# EAGLE design kooz_v0.1 (EAGLE 7.2.0)
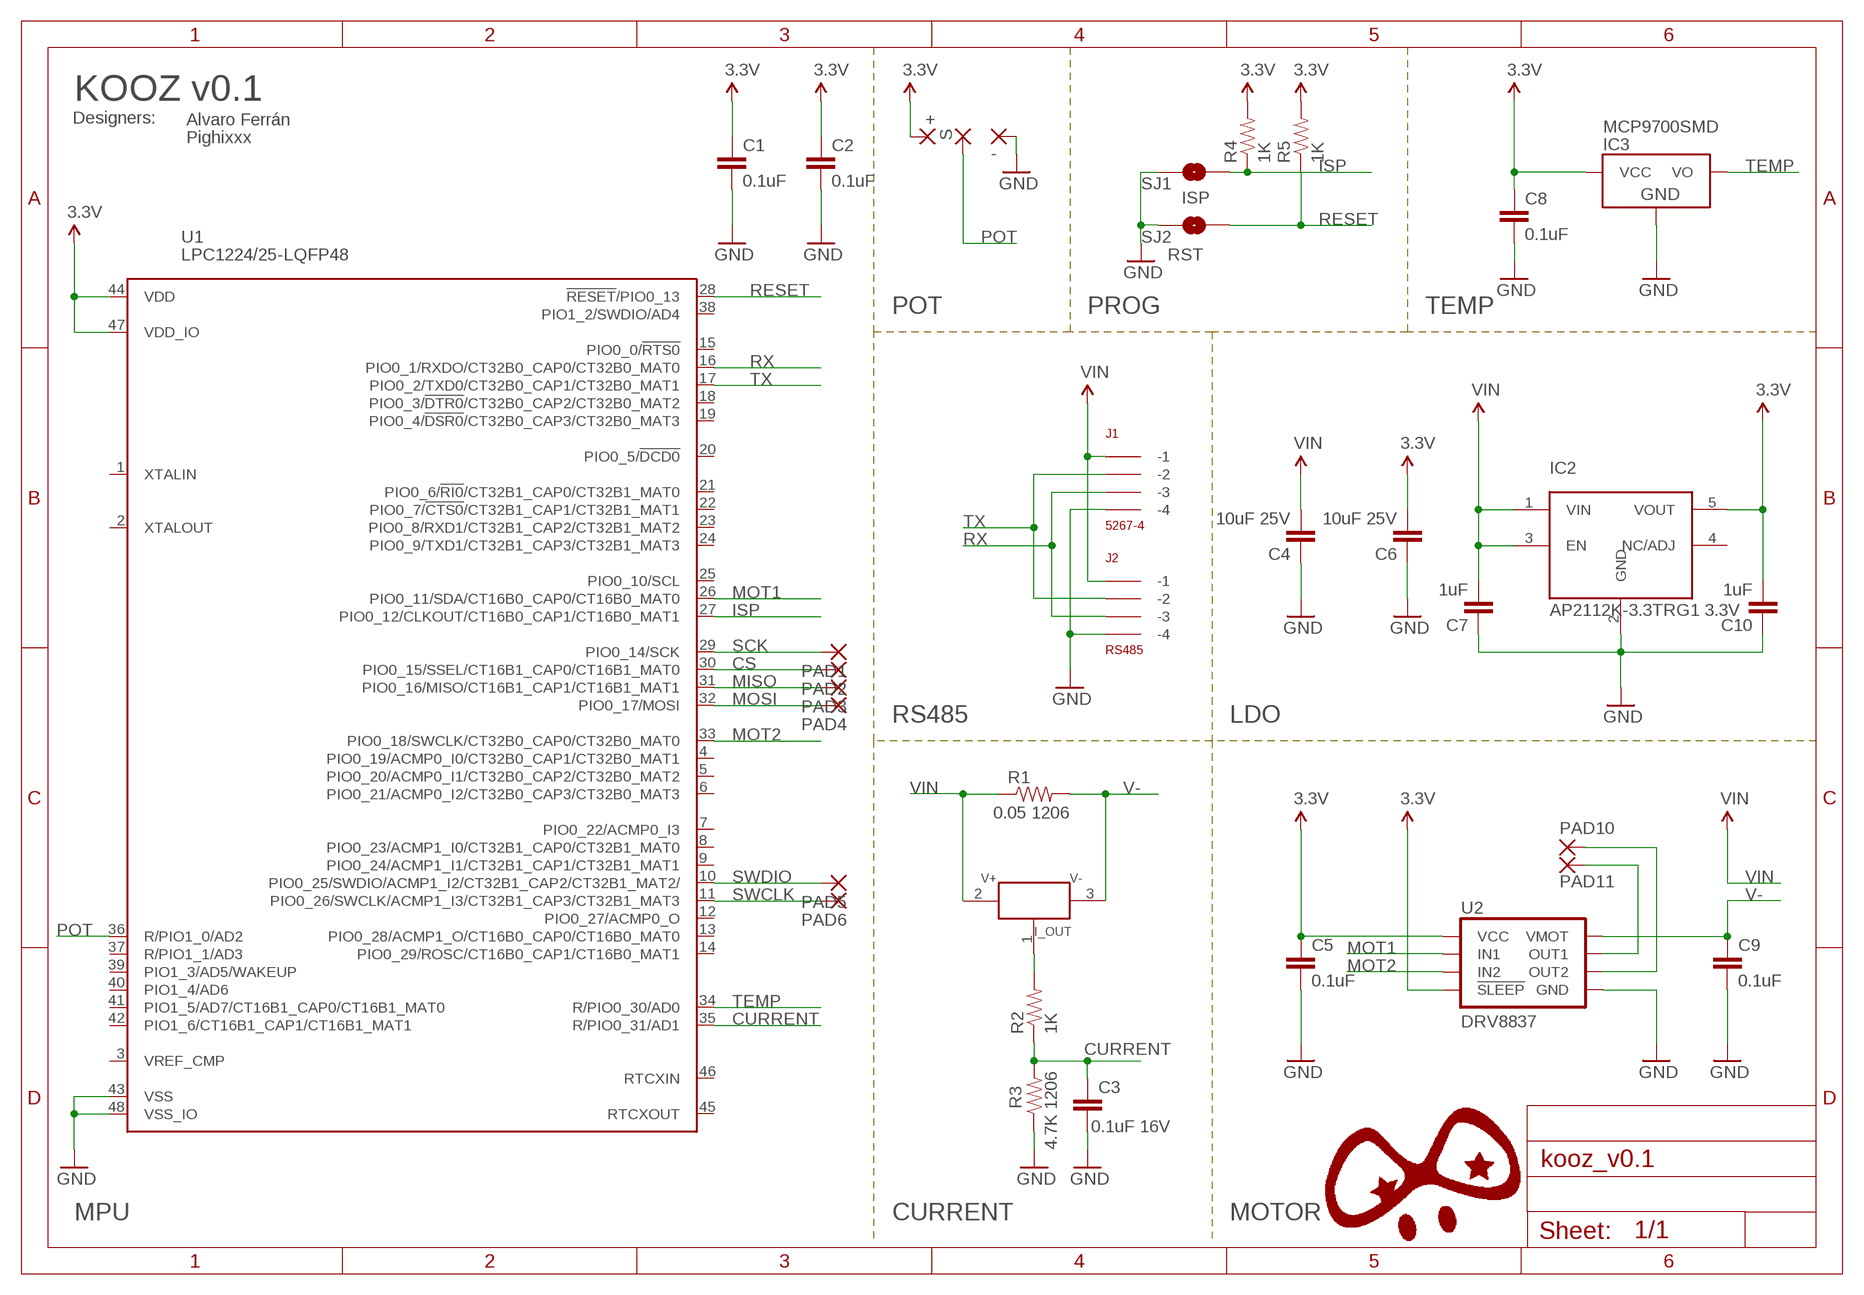
[diagram p0: schematic, sheet 1]

## Parts
C1  0.1uF  CAP0402-CAP  [0402-CAP]
C2  0.1uF  CAP0402-CAP  [0402-CAP]
C3  0.1uF 16V  CAP0402-CAP  [0402-CAP]
C4  10uF 25V  CAP0603-CAP  [0603-CAP]
C5  0.1uF  CAP0402-CAP  [0402-CAP]
C6  10uF 25V  CAP0603-CAP  [0603-CAP]
C7  1uF  CAP0402-CAP  [0402-CAP]
C8  0.1uF  CAP0402-CAP  [0402-CAP]
C9  0.1uF  CAP0402-CAP  [0402-CAP]
C10  1uF  CAP0402-CAP  [0402-CAP]
IC1  ZXCT1008  [SOT23]
IC2  AP2112K-3.3TRG1 3.3V  5PIN_REG  [SOT23-5]
IC3  MCP9700SMD  [SOT23-3]
J1  5267-4  [5267-4]
J2  RS485  5267-4  [5267-4]
PAD1  SMD2  [SMD1,27-2,54]
PAD2  SMD2  [SMD1,27-2,54]
PAD3  SMD2  [SMD1,27-2,54]
PAD4  SMD2  [SMD1,27-2,54]
PAD5  SMD2  [SMD1,27-2,54]
PAD6  SMD2  [SMD1,27-2,54]
PAD7  +  2,54/1,1  [2,54/1,1]
PAD8  S  2,54/1,1  [2,54/1,1]
PAD9  -  2,54/1,1  [2,54/1,1]
PAD10  2,54/1,1  [2,54/1,1]
PAD11  2,54/1,1  [2,54/1,1]
R1  0.05 1206  RESISTOR  [1206-RES]
R2  1K  RESISTOR0402-RES  [0402-RES]
R3  4.7K 1206  RESISTOR  [1206-RES]
R4  1K  RESISTOR0402-RES  [0402-RES]
R5  1K  RESISTOR0402-RES  [0402-RES]
SJ1  ISP  SOLDERJUMPERNO  [SJ_2S-NO]
SJ2  RST  SOLDERJUMPERNO  [SJ_2S-NO]
U1  LPC1224/25-LQFP48  [LQFP48]
U2  DRV8837  [DSG]

## Nets
3.3V: C1.1 C2.1 C5.1 C6.2 C8.1 C10.2 IC2.5(VOUT) IC3.1(VCC) PAD7.1(P) R4.2 R5.2 U1.44(VDD) U1.47(VDD_IO) U2.7(!SLEEP) U2.8(VCC)
CS: PAD2.1(P) U1.30(PIO0_15/SSEL/CT16B1_CAP0/CT16B1_MAT0)
CURRENT: C3.1 R2.1 R3.2 U1.35(R/PIO0_31/AD1)
GND: C1.2 C2.2 C3.2 C4.1 C5.2 C6.1 C7.1 C8.2 C9.2 C10.1 IC2.2(GND) IC3.3(GND) J1.P$4(-4) J2.P$4(-4) PAD9.1(P) R3.1 SJ1.1 SJ2.1 U1.43(VSS) U1.48(VSS_IO) U2.4(GND) U2.PAD(GND)
ISP: R4.1 SJ1.2 U1.27(PIO0_12/CLKOUT/CT16B0_CAP1/CT16B0_MAT1)
MISO: PAD3.1(P) U1.31(PIO0_16/MISO/CT16B1_CAP1/CT16B1_MAT1)
MOSI: PAD4.1(P) U1.32(PIO0_17/MOSI)
MOT1: U1.26(PIO0_11/SDA/CT16B0_CAP0/CT16B0_MAT0) U2.6(IN1)
MOT2: U1.33(PIO0_18/SWCLK/CT32B0_CAP0/CT32B0_MAT0) U2.5(IN2)
N$11: PAD11.1(P) U2.2(OUT1)
N$12: PAD10.1(P) U2.3(OUT2)
N$15: IC1.1(I_OUT) R2.2
POT: PAD8.1(P) U1.36(R/PIO1_0/AD2)
RESET: R5.1 SJ2.2 U1.28(!RESET!/PIO0_13)
RX: J1.P$3(-3) J2.P$3(-3) U1.16(PIO0_1/RXDO/CT32B0_CAP0/CT32B0_MAT0)
SCK: PAD1.1(P) U1.29(PIO0_14/SCK)
SWCLK: PAD6.1(P) U1.11(PIO0_26/SWCLK/ACMP1_I3/CT32B1_CAP3/CT32B1_MAT3)
SWDIO: PAD5.1(P) U1.10(PIO0_25/SWDIO/ACMP1_I2/CT32B1_CAP2/CT32B1_MAT2/)
TEMP: IC3.2(VO) U1.34(R/PIO0_30/AD0)
TX: J1.P$2(-2) J2.P$2(-2) U1.17(PIO0_2/TXD0/CT32B0_CAP1/CT32B0_MAT1)
V-: C9.1 IC1.3(V-) R1.2 U2.1(VMOT)
VIN: C4.2 C7.2 IC1.2(V+) IC2.1(VIN) IC2.3(EN) J1.P$1(-1) J2.P$1(-1) R1.1
Unconnected: IC2.4(NC/ADJ) U1.1(XTALIN) U1.2(XTALOUT) U1.3(VREF_CMP) U1.4(PIO0_19/ACMP0_I0/CT32B0_CAP1/CT32B0_MAT1) U1.5(PIO0_20/ACMP0_I1/CT32B0_CAP2/CT32B0_MAT2) U1.6(PIO0_21/ACMP0_I2/CT32B0_CAP3/CT32B0_MAT3) U1.7(PIO0_22/ACMP0_I3) U1.8(PIO0_23/ACMP1_I0/CT32B1_CAP0/CT32B1_MAT0) U1.9(PIO0_24/ACMP1_I1/CT32B1_CAP1/CT32B1_MAT1) U1.12(PIO0_27/ACMP0_O) U1.13(PIO0_28/ACMP1_O/CT16B0_CAP0/CT16B0_MAT0) U1.14(PIO0_29/ROSC/CT16B0_CAP1/CT16B0_MAT1) U1.15(PIO0_0/!RTS0!) U1.18(PIO0_3/!DTR0!/CT32B0_CAP2/CT32B0_MAT2) U1.19(PIO0_4/!DSR0!/CT32B0_CAP3/CT32B0_MAT3) U1.20(PIO0_5/!DCD0!) U1.21(PIO0_6/!RI0!/CT32B1_CAP0/CT32B1_MAT0) U1.22(PIO0_7/!CTS0!/CT32B1_CAP1/CT32B1_MAT1) U1.23(PIO0_8/RXD1/CT32B1_CAP2/CT32B1_MAT2) U1.24(PIO0_9/TXD1/CT32B1_CAP3/CT32B1_MAT3) U1.25(PIO0_10/SCL) U1.37(R/PIO1_1/AD3) U1.38(PIO1_2/SWDIO/AD4) U1.39(PIO1_3/AD5/WAKEUP) U1.40(PIO1_4/AD6) U1.41(PIO1_5/AD7/CT16B1_CAP0/CT16B1_MAT0) U1.42(PIO1_6/CT16B1_CAP1/CT16B1_MAT1) U1.45(RTCXOUT) U1.46(RTCXIN)

## Notes on the sheet
- KOOZ v0.1
- Designers: | Alvaro Ferrán
- Pighixxx
- POT | PROG | TEMP
- RS485 | LDO
- MPU | CURRENT | MOTOR

## Library data of the parts
C1-C10 = SparkFun-Passives:CAP: Capacitor Standard 0603 ceramic capacitor, and 0.1" leaded capacitor.
IC1 = pighiXXX:ZXCT1008: The ZXCT1008 is a high side current sense monitor
IC2 = GHI:5PIN_REG
IC3 = SparkFun-Sensors:MCP9700: Analog-output temperature sensor; PROD_ID: IC-08917
J1 J2 = con-molex-spox:5267-4
PAD1-PAD6 = wirepad:SMD2: SMD PAD
PAD7-PAD11 = wirepad:2,54/1,1: THROUGH-HOLE PAD
R1-R5 = SparkFun-Passives:RESISTOR: Resistor Basic schematic elements and footprints for 0603, 1206, and PTH resistors.
SJ1 SJ2 = SparkFun-Retired:SOLDERJUMPER: Solder Jumper Standard SMD solder jumper. Used to automate production. Two varients : Normally Open and Normally Closed are the same, but have different paste layers. NC will have a large amount of paste and should jumper during reflow.
U1 = LPC122x_LQFP48:LPC1224/25-LQFP48: NXP Semiconductors LPC1224/25 microcontrollers <http://www.nxp.com/products/microcontrollers/cortex_m0/lpc1200/> ARM 32-bit Cortex-M0 Microcontroller with MPU CPU clock up to 50MHz up to 80 KByte on-chip Flash ROM with In-System Programming (ISP) and In-Application Programming (IAP) via On-Chip Bootloader 4 to 8 KByte SRAM Nested Vectored Interrupt Controller SPI controllers Micro-DMA controller with 21 channels CRC-Engine UART with full Modem Interface and RS485 Support Fast Mode I2C-Bus 4 Timers with 4 capture channels and 12 output channels Watchdog (WDT) Sytem tick timer Real-Time Clock (RTC) 10-bit ADC with 8 channels Analog Comparators with 555-like output Power Management Unit (PMU) Brownout detection 12MHz internal RC oscillator Serial Wire Debug/Trace port
U2 = packages(ti):DRV8837

## Net classes
0 default: width 0.254 mm, drill 0.254 mm, clearance 0.203 mm

## Board
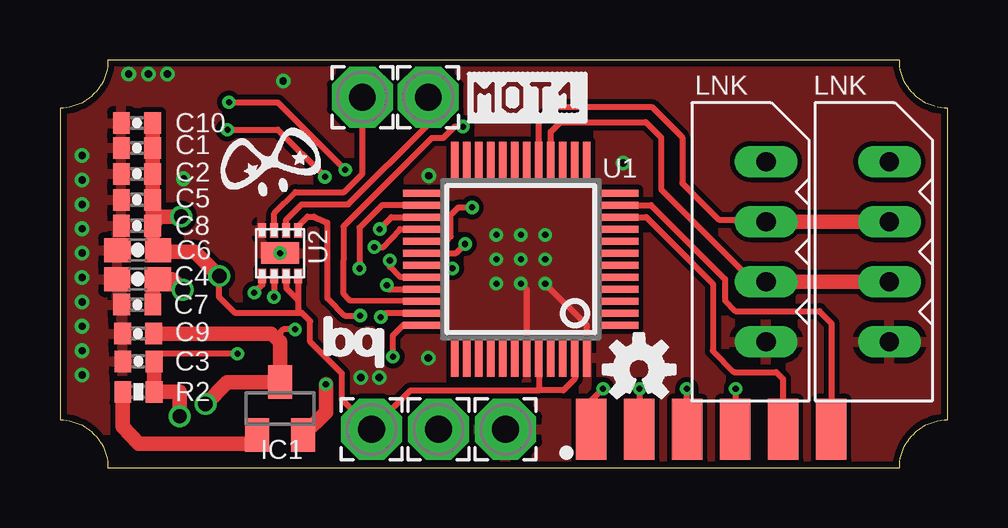
[diagram p1: board, top side]
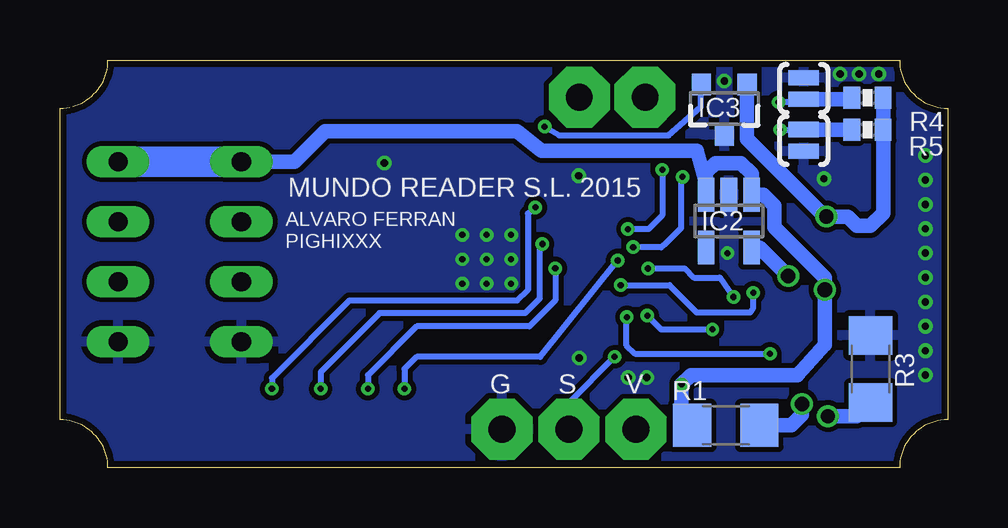
[diagram p2: board, bottom side, seen from below]

Size 37 x 17 mm. Coordinates in mm from the lower left corner, seen from the top.
Outline: 36.47,15.07 36.34,15.11 36.22,15.16 36.1,15.21 35.99,15.27 35.88,15.34 35.78,15.41 35.68,15.5 35.59,15.59 35.5,15.68 35.41,15.78 35.34,15.88 35.27,15.99 35.21,16.1 35.16,16.22 35.11,16.34 35.07,16.47 35.04,16.6 35.01,16.73 35,16.86 35,17 2,17 2,16.86 1.99,16.73 1.96,16.6 1.93,16.47 1.89,16.34 1.84,16.22 1.79,16.1 1.73,15.99 1.66,15.88 1.59,15.78 1.5,15.68 1.41,15.59 1.32,15.5 1.22,15.41 1.12,15.34 1.01,15.27 0.9,15.21 0.66,15.11 0.53,15.07 0.4,15.04 0.27,15.01 0.14,15 0,15 0,2 0.14,2 0.27,1.99 0.4,1.96 0.53,1.93 0.66,1.89 0.9,1.79 1.01,1.73 1.12,1.66 1.22,1.59 1.32,1.5 1.41,1.41 1.5,1.32 1.59,1.22 1.66,1.12 1.73,1.01 1.79,0.9 1.84,0.78 1.89,0.66 1.93,0.53 1.96,0.4 1.99,0.27 2,0.14 2,0 35,0 35,0.14 35.01,0.27 35.04,0.4 35.07,0.53 35.11,0.66 35.21,0.9 35.27,1.01 35.34,1.12 35.41,1.22 35.5,1.32 35.59,1.41 35.68,1.5 35.78,1.59 35.88,1.66 35.99,1.73 36.1,1.79 36.22,1.84 36.34,1.89 36.47,1.93 36.6,1.96 36.73,1.99 36.86,2 37,2 37,15 36.86,15 36.73,15.01 36.6,15.04
Copper layers (1*16): Top 0.035mm / dielectric 1.5mm / Bottom 0.035mm
Design rules "pighixxx_CAM_DRC_V1.0": minimum track width 6mil, minimum drill 12mil, track to track 6mil, track to pad 6mil, pad to pad 6mil, via to via 6mil, smd to smd 0mil, copper to edge 10mil, drill to drill 10mil, minimum pad ring 10mil, minimum via ring 6mil, stop-mask expansion 2mil, vias tented up to drill 100mil, thermal gap 10mil

### Footprints (pad centres in the part's own frame; a part is rotated, then mirrored left to right if it is on the bottom)
0402-CAP = smd 0.7 x 0.9: 1 -0.65,0; 2 0.65,0
0603-CAP = smd 1.1 x 1: 1 -0.85,0; 2 0.85,0
SOT23 = smd 1 x 1.4: 1 -0.95,-1.1; 2 0.95,-1.1; 3 0,1.1
SOT23-5 = smd 0.7 x 1.4: 1 0.95,1.1; 2 0,1.1; 3 -0.95,1.1; 4 -0.95,-1.1; 5 0.95,-1.1
SOT23-3 = smd 0.8 x 0.9: 1 -0.95,-1; 2 0.95,-1; 3 0,1.1
5267-4 = drill 0.8 long: P$1 0,0; P$2 2.5,0; P$3 5,0; P$4 7.5,0
SMD1,27-2,54 = smd 1.27 x 2.54: 1 0,0
2,54/1,1 = drill 1.118 pad 2.54 octagon: 1 0,0
1206-RES = smd 1.6 x 1.8: 1 -1.4,0; 2 1.4,0
0402-RES = smd 0.7 x 0.9: 1 -0.65,0; 2 0.65,0
SJ_2S-NO = smd 0.635 x 1.27: 1 -0.45,0; 2 0.45,0
LQFP48 = smd 0.3 x 1.6: 1 -2.75,-4.1; 2 -2.25,-4.1; 3 -1.75,-4.1; 4 -1.25,-4.1; 5 -0.75,-4.1; 6 -0.25,-4.1; 7 0.25,-4.1; 8 0.75,-4.1; 9 1.25,-4.1; 10 1.75,-4.1; 11 2.25,-4.1; 12 2.75,-4.1; 25 2.75,4.1; 26 2.25,4.1; 27 1.75,4.1; 28 1.25,4.1; 29 0.75,4.1; 30 0.25,4.1; 31 -0.25,4.1; 32 -0.75,4.1; 33 -1.25,4.1; 34 -1.75,4.1; 35 -2.25,4.1; 36 -2.75,4.1 | smd 1.6 x 0.3: 13 4.1,-2.75; 14 4.1,-2.25; 15 4.1,-1.75; 16 4.1,-1.25; 17 4.1,-0.75; 18 4.1,-0.25; 19 4.1,0.25; 20 4.1,0.75; 21 4.1,1.25; 22 4.1,1.75; 23 4.1,2.25; 24 4.1,2.75; 37 -4.1,2.75; 38 -4.1,2.25; 39 -4.1,1.75; 40 -4.1,1.25; 41 -4.1,0.75; 42 -4.1,0.25; 43 -4.1,-0.25; 44 -4.1,-0.75; 45 -4.1,-1.25; 46 -4.1,-1.75; 47 -4.1,-2.25; 48 -4.1,-2.75
DSG = smd 0.6 x 0.35: 1 -0.95,0.75; 2 -0.95,0.25; 3 -0.95,-0.25; 4 -0.95,-0.75; 5 0.95,-0.75; 6 0.95,-0.25; 7 0.95,0.25; 8 0.95,0.75 | smd 0.9 x 1.6: PAD 0,0

### Placement (x,y rotation side)
C1  3.21,13.33 180 top
C2  3.21,12.25 180 top
C3  3.27,4.44 180 top
C4  3.24,7.87 0 top
C5  3.21,11.17 180 top
C6  3.24,9.08 0 top
C7  3.22,6.81 0 top
C8  3.21,10.1 180 top
C9  3.26,5.6 180 top
C10  3.21,14.37 0 top
IC1  9.18,2.48 0 top
IC2  9.12,10.29 0 bottom
IC3  9.31,14.98 180 bottom
J1  29.44,12.76 270 top
J2  34.58,12.76 270 top
LOGO1  OSHW-LOGOS  [OSHW-LOGO-S]  24.14,4.1 0 top
PAD1  28.15,1.61 0 top
PAD2  26.15,1.61 0 top
PAD3  24.15,1.61 0 top
PAD4  22.15,1.61 0 top
PAD5  30.15,1.61 0 top
PAD6  32.15,1.61 0 top
PAD7  12.99,1.61 90 top
PAD8  15.78,1.61 90 top
PAD9  18.58,1.61 90 top
PAD10  12.61,15.45 90 top
PAD11  15.35,15.45 90 top
R1  9.24,1.78 0 bottom
R2  3.27,3.17 180 top
R3  3.21,4.13 270 bottom
R4  3.34,15.43 0 bottom
R5  3.34,14.1 0 bottom
SJ1  5.99,15.81 270 bottom
SJ2  5.99,13.65 90 bottom
U1  19.21,8.7 90 top
U2  9.18,8.95 270 top
U$1  [S_MOT1]  17.07,16.41 270 top
U$2  [PIGHIXXX_LOGO]  6.7,11.33 0 top
U$3  [BQ_LOGO_SMALL]  10.88,4.1 0 top

### Tracks (layer width: path | path; a pad name or v marks a point on that pad's centre or on a via)
3.3V  (via drill 0.6)
  Top 0.254: U1.44 19.96,3.24 | U1.47 21.46,3.71 20.99,3.24 19.96,3.24 | 6.64,7.94 v6.64,8 6.64,7.11 7.27,6.48 9.93,6.48 | 19.96,3.24 14.61,3.24 PAD7.1 11.76,2.84 11.76,3.94 10.44,5.26 10.44,6.11 10.07,6.48 9.93,6.48 | U2.8 9.93,7 | U2.7 9.43,7.5 9.93,7 | 9.93,7 9.93,6.48
  Top 0.61: C8.1 C5.1 C2.1 C1.1 C10.2 | v5.05,10.48 4.16,10.48 4.04,10.35 C8.1 | v6.64,8 5.62,9.02 4.09,9.02 C6.2 3.86,9.08 C8.1
  Bottom 0.61: R4.2 R5.2 2.69,10.62 3.21,10.1 3.78,10.1 4.16,10.48 v5.05,10.48 5.11,10.48 8.36,13.72 IC3.1 | v6.64,8 7.82,9.19 IC2.5
CS  (via drill 0.25)
  Top 0.254: U1.30 16.5,8.95 v16.89,9.33 | PAD2.1 26.13,1.63 v26.13,3.3
  Bottom 0.254: v16.89,9.33 17,9.18 17,7.06 17.61,6.45 23.68,6.45 26.13,4 v26.13,3.3
CURRENT  (via drill 0.25, 0.6)
  Top 0.254: U1.35 13.59,6.45 v13.37,6.29 | v7.4,4.76 4.16,4.76 C3.1
  Top 0.61: C3.1 R2.1 4.99,3.17 v4.99,2.16
  Bottom 0.254: v7.4,4.76 13.04,4.76 13.38,5.1 13.38,6.27 v13.37,6.29
  Bottom 0.61: v4.99,2.16 3.78,2.16 R3.2
GND  (via drill 0.25, 0.3)
  Top 0.254: U1.43 19.46,7.43 v19.21,7.68 | U1.48 21.96,5.95 v20.23,7.68 | 9.24,8.89 U2.PAD
  other vias: 0.92,13.02 0.92,12 0.92,10.98 0.92,9.97 0.92,8.95 0.92,7.94 0.92,6.92 0.92,5.9 0.92,4.89 0.92,3.87 20.23,9.71 20.23,8.7 18.2,9.71 18.2,8.7 18.2,7.68 19.21,9.71 19.21,8.7 9.18,8.95 12.54,3.77 13.32,3.77 15.35,4.58 3.69,16.42 4.48,16.42 5.15,12.05 9.31,16.13 2.87,16.42 23.48,12.71 15.38,12.18
  pour Bottom: -3.52,20.38 38.39,20.38 38.39,-1.21 -3.52,-1.21
  pour Top: -2.25,19.11 39.66,19.11 39.66,-2.48 -2.25,-2.48
ISP  (via drill 0.25)
  Top 0.254: U1.27 13.82,10.45 v13.33,9.96 | v7.04,15.24 9.08,15.24 v11.89,12.43
  Bottom 0.254: SJ1.2 6.11,15.24 v7.04,15.24 | v11.89,12.43 11.89,10.53 12.47,9.96 v13.33,9.96
  Bottom 0.61: R4.1 4.06,15.36 SJ1.2
MISO  (via drill 0.25)
  Top 0.254: U1.31 16.22,8.45 v16.35,8.32 | v24.16,3.3 PAD3.1
  Bottom 0.254: v16.35,8.32 16.35,6.98 17.43,5.9 22.13,5.9 24.16,3.87 v24.16,3.3
MOSI  (via drill 0.25)
  Top 0.254: U1.32 14.18,7.95 13.75,8.38 v13.75,8.65 | 22.13,1.63 PAD4.1 22.15,2.81 v22.64,3.3
  Bottom 0.254: v13.75,8.65 16.99,4.63 22.13,4.63 22.64,4.13 v22.64,3.3
MOT1  (via drill 0.25)
  Top 0.254: U1.26 13.44,10.95 12.48,10.02 v12.49,8.31 | U2.6 v8.92,7.12
  Bottom 0.254: v8.92,7.12 9.5,7.94 10.58,7.94 10.96,8.32 v12.49,8.31
MOT2  (via drill 0.25)
  Top 0.254: v8.1,7.3 8.43,7.63 U2.5 | U1.33 15.09,7.43 13.69,7.43 v13.62,7.62
  Bottom 0.254: v13.62,7.62 11.59,7.62 10.45,6.48 8.23,6.48 8.1,6.67 v8.1,7.3
N$11
  Top 0.254: U2.2 9.43,10.35 10.07,10.98 12.02,10.98 15.32,14.29 15.4,15.45 PAD11.1
N$12
  Top 0.254: U2.3 8.93,10.61 9.81,11.49 11.85,11.49 12.61,12.25 PAD10.1
N$15
  Top 0.61: R2.2 2.62,1.73 3.27,1.01 7.87,1.01 8.23,1.12 IC1.1
POT  (via drill 0.25)
  Top 0.254: v13.88,4.63 13.88,5.52 14.3,5.95 U1.36
  Bottom 0.254: v13.88,4.63 15.78,2.73 PAD8.1
RESET  (via drill 0.25)
  Top 0.254: v13.1,9.21 13.47,9.21 14.17,9.96 15.1,9.96 U1.28 | v6.98,14.1 9.08,14.1 v11.05,12.13
  Bottom 0.254: SJ2.2 v6.98,14.1 | v11.05,12.13 11.11,11.94 11.11,9.99 11.78,9.32 11.95,9.19 v13.1,9.21
  Bottom 0.61: SJ2.2 R5.1
RX
  Top 0.254: U1.16 20.46,14.01 20.86,14.41 24.42,14.41 25.05,13.78 25.05,11.62 28.86,7.81 29.45,7.81 J1.P$3
  Top 0.61: J2.P$3 J1.P$3
SCK  (via drill 0.25)
  Top 0.254: U1.29 16.09,9.45 16.29,9.65 16.29,10.54 16.61,10.86 v17.18,10.86 | v28.17,3.3 PAD1.1
  Bottom 0.254: v17.18,10.86 17.5,10.6 17.5,7.42 17.94,6.97 24.94,6.97 28.17,3.75 v28.17,3.3
SWCLK
  Top 0.254: U1.11 24.65,10.95 27.72,7.87 27.72,6.98 28.17,6.54 31.66,6.54 32.17,6.03 PAD6.1
SWDIO
  Top 0.254: U1.10 24.45,10.45 27.21,7.68 27.21,4.89 28.1,4 29.86,4 30.15,3.7 PAD5.1
TEMP  (via drill 0.25)
  Top 0.254: U1.34 12.1,6.97 11.81,7.28 11.82,10.07 15.49,13.74 15.97,13.74 16.46,14.22 v16.8,14.22
  Bottom 0.254: v16.8,14.22 16.18,13.85 11.63,13.85 10.28,15.05 10.28,15.96 IC3.2
TX
  Top 0.254: U1.17 19.96,14.4 20.61,15.05 24.67,15.05 25.94,13.78 25.94,11.87 27.47,10.35 29.41,10.35 J1.P$2
  Top 0.61: J1.P$2 J2.P$2
V-  (via drill 0.25, 0.61)
  Top 0.254: U2.1 9.93,10.08 10.32,10.48 10.58,10.48 11.15,10.22 11.15,7.07 11.87,6.35 v12.52,6.35 | v9.8,5.78 9.31,5.78 9.18,5.65 9.18,5.27
  Top 0.61: v6.07,2.67 6.98,3.57 IC1.3 9.18,5.27 8.8,5.59 3.92,5.59 C9.1
  Bottom 0.254: v12.52,6.35 11.95,5.78 v9.8,5.78
  Bottom 0.61: v6.07,2.67 6.07,2.22 6.51,1.78 R1.2
VIN  (via drill 0.25, 0.61)
  Top 0.61: v5.11,7.43 4.67,7.87 C4.2 3.87,7.87 C7.2 | IC1.2 11.08,2.33 v11.08,3.49
  Bottom 0.61: J1.P$1 27.21,12.76 25.94,14.03 17.94,14.03 16.92,13.22 10.44,13.22 10.07,11.87 | R1.1 11.08,2.22 v11.08,3.49 10.7,3.87 6.26,3.87 5.11,5.14 v5.11,7.43 5.11,7.94 7.21,10.03 7.21,10.92 7.68,11.39 IC2.1 8.17,12.26 8.61,12.7 9.69,12.7 10.07,12.32 10.07,11.87 | IC2.3 10.07,11.87
  Bottom 1.27: J1.P$1 J2.P$1

### Text on the board
tPlace: LNK | LNK
bPlace: V | S | G
bNames: MUNDO READER S.L. 2015 | ALVARO FERRAN / PIGHIXXX